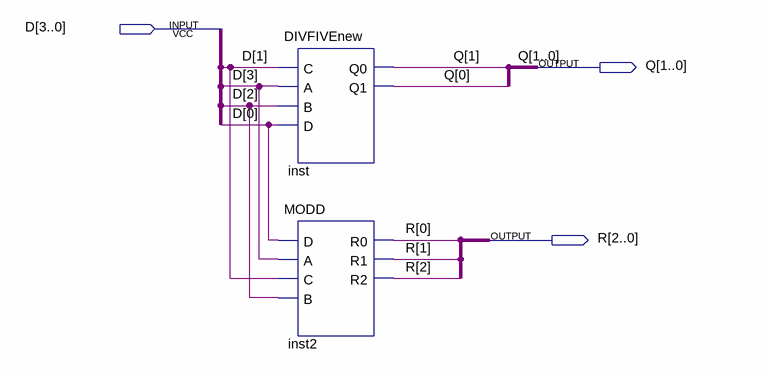
[diagram p0: schematic sheet]
// Quartus schematic FourBitDIV.bdf as structural Verilog: 2 symbols, 3 pins
module FourBitDIV (
  input  [3:0] D,
  output [1:0] Q,
  output [2:0] R
);

  DIVFIVEnew inst (.C(D[1]), .A(D[3]), .B(D[2]), .D(D[0]), .Q0(Q[1]), .Q1(Q[0]));
  MODD inst2 (.D(D[0]), .A(D[3]), .C(D[1]), .B(D[2]), .R0(R[0]), .R1(R[1]), .R2(R[2]));
endmodule
